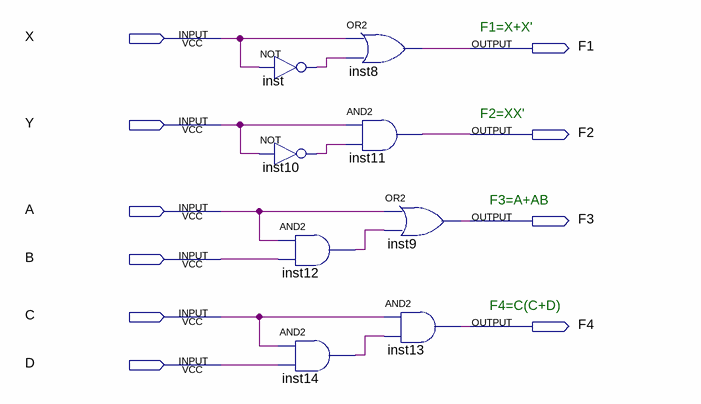
[diagram p0: schematic sheet]
// Quartus schematic Boolean.bdf as structural Verilog: 8 symbols, 10 pins
module Boolean (
  input  X,
  input  Y,
  input  A,
  input  B,
  input  C,
  input  D,
  output F1,
  output F2,
  output F3,
  output F4
);

  wire inst10_out, inst12_out, inst14_out, inst_out;

  not inst (inst_out, X);
  not inst10 (inst10_out, Y);
  and inst12 (inst12_out, A, B);
  and inst14 (inst14_out, C, D);
  or inst8 (F1, X, inst_out);
  and inst11 (F2, Y, inst10_out);
  or inst9 (F3, A, inst12_out);
  and inst13 (F4, C, inst14_out);

  // Notes on the sheet:
  //   F1=X+X'
  //   F2=XX'
  //   F3=A+AB
  //   F4=C(C+D)
endmodule
